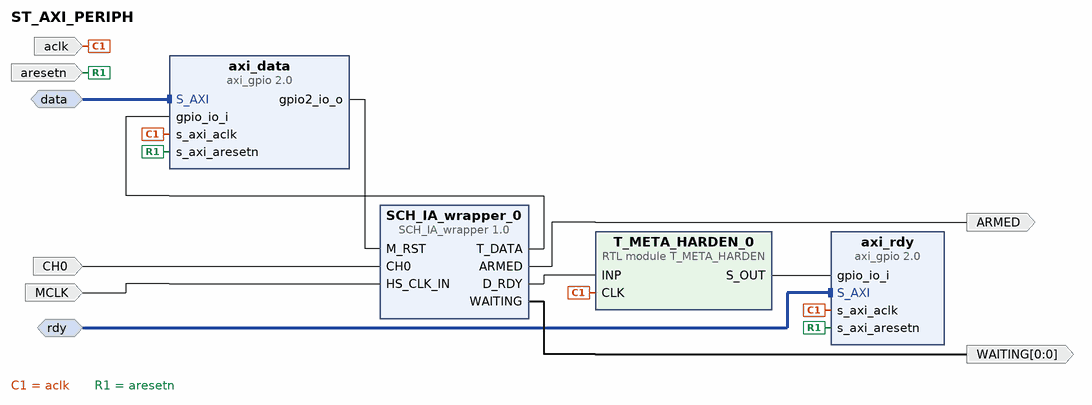
[diagram p0: block diagram of the top level]
# Vivado block design ST_AXI_PERIPH, xc7z020clg400-1, Vivado 2019.1
create_bd_design ST_AXI_PERIPH

create_bd_intf_port -mode Slave -vlnv xilinx.com:interface:aximm_tlm:1.0 data
create_bd_intf_port -mode Slave -vlnv xilinx.com:interface:aximm_tlm:1.0 rdy
create_bd_port -dir O ARMED
create_bd_port -dir O -from 0 -to 0 WAITING
create_bd_port -dir I CH0
create_bd_port -dir I aclk
create_bd_port -dir I aresetn
create_bd_port -dir I MCLK

create_bd_cell -type ip -vlnv xilinx.com:ip:axi_gpio:2.0 axi_data
set_property -dict [list \
  CONFIG.C_ALL_INPUTS 1 \
  CONFIG.C_ALL_OUTPUTS_2 1 \
  CONFIG.C_GPIO2_WIDTH 1 \
  CONFIG.C_IS_DUAL 1 \
] [get_bd_cells axi_data]
create_bd_cell -type ip -vlnv xilinx.com:ip:axi_gpio:2.0 axi_rdy
set_property -dict {CONFIG.C_ALL_INPUTS 1 CONFIG.C_GPIO_WIDTH 1} [get_bd_cells axi_rdy]
create_bd_cell -type module -reference T_META_HARDEN T_META_HARDEN_0
create_bd_cell -type ip -vlnv cri.nz:user:SCH_IA_wrapper:1.0 SCH_IA_wrapper_0

# ---- connections ----

connect_bd_intf_net [get_bd_intf_ports data] [get_bd_intf_pins axi_data/S_AXI]
connect_bd_intf_net [get_bd_intf_ports rdy] [get_bd_intf_pins axi_rdy/S_AXI]
connect_bd_net [get_bd_pins T_META_HARDEN_0/S_OUT] [get_bd_pins axi_rdy/gpio_io_i]
connect_bd_net [get_bd_ports aclk] [get_bd_pins axi_rdy/s_axi_aclk] [get_bd_pins axi_data/s_axi_aclk] [get_bd_pins T_META_HARDEN_0/CLK]
connect_bd_net [get_bd_ports aresetn] [get_bd_pins axi_rdy/s_axi_aresetn] [get_bd_pins axi_data/s_axi_aresetn]
connect_bd_net -net CH0_1 [get_bd_ports CH0] [get_bd_pins SCH_IA_wrapper_0/CH0]
connect_bd_net [get_bd_ports MCLK] [get_bd_pins SCH_IA_wrapper_0/HS_CLK_IN]
connect_bd_net [get_bd_pins axi_data/gpio2_io_o] [get_bd_pins SCH_IA_wrapper_0/M_RST]
connect_bd_net [get_bd_pins SCH_IA_wrapper_0/T_DATA] [get_bd_pins axi_data/gpio_io_i]
connect_bd_net [get_bd_pins SCH_IA_wrapper_0/D_RDY] [get_bd_pins T_META_HARDEN_0/INP]
connect_bd_net [get_bd_pins SCH_IA_wrapper_0/ARMED] [get_bd_ports ARMED]
connect_bd_net [get_bd_pins SCH_IA_wrapper_0/WAITING] [get_bd_ports WAITING]

validate_bd_design
save_bd_design
